# Altium schematic sheet imu.SchDoc
size A
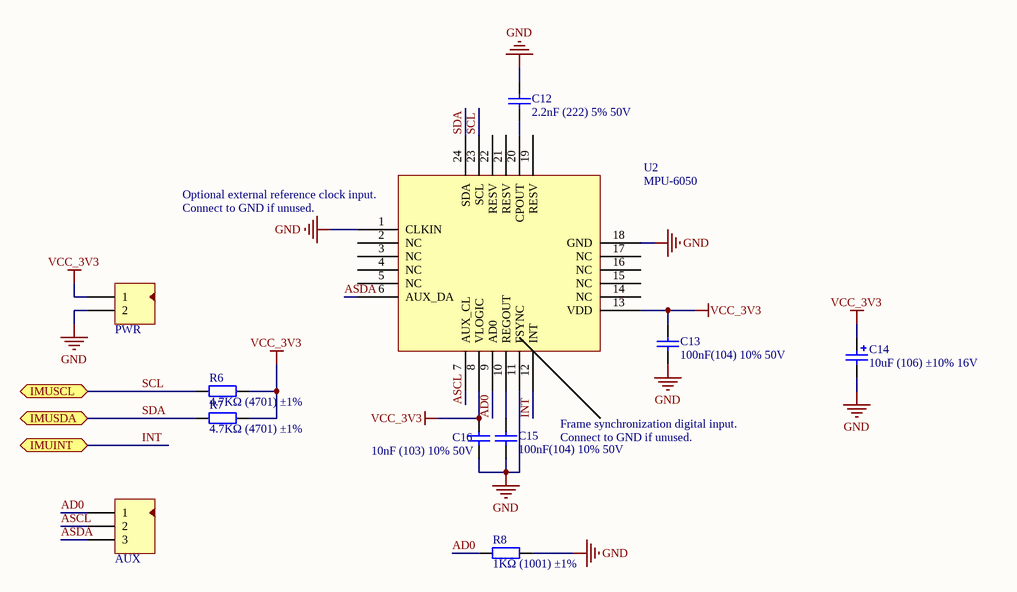
[diagram p0: imu.SchDoc]

## Parts
C12  2.2nF (222) 5% 50V  [LC-0805_C]
C13  100nF(104) 10% 50V  [LC-0805_C]
C14  10uF (106) ±10% 16V  [LC-CASE-A_3216]
C15  100nF(104) 10% 50V  [LC-0805_C]
C16  10nF (103) 10% 50V  [LC-0805_C]
P6  PWR  [HDR2X1-2.54]
P7  AUX  [HDR3X1-2.54]
R6  4.7KΩ (4701) ±1%  [LC-0805_R]
R7  4.7KΩ (4701) ±1%  [LC-0805_R]
R8  1KΩ (1001) ±1%  [LC-0805_R]
U2  MPU-6050  [LC-QFN-24_4x4x05P]

## Ports
IMUINT, IMUSCL, IMUSDA

## Nets
GND: C12.2 C13.1 C14.2 C15.2 C16.1 P6.2 R8.2 U2.1(CLKIN) U2.11(FSYNC) U2.18(GND)
VCC_3V3: C13.2 C14.1 C16.2 P6.1 R6.2 R7.2 U2.8(VLOGIC) U2.13(VDD)
AD0: P7.1 R8.1 U2.9(AD0)
ASCL: P7.2 U2.7(AUX_CL)
ASDA: P7.3 U2.6(AUX_DA)
INT: U2.12(INT) ; port IMUINT
SCL: R6.1 U2.23(SCL) ; port IMUSCL
SDA: R7.1 U2.24(SDA) ; port IMUSDA
NetC12_1: C12.1 U2.20(CPOUT)
NetC15_1: C15.1 U2.10(REGOUT)

Not connected (* = marked no-connect by the designer): U2 2(NC) 3(NC) 4(NC) 5(NC) 14(NC) 15(NC) 16(NC) 17(NC) 19(RESV) 21(RESV) 22(RESV)

## Notes on the sheet
- (near U2) Optional external reference clock input.
- Connect to GND if unused.
- Frame synchronization digital input.

## Library data of the parts
C12 = 0805 2.2nF (222) 5% 50V: 贴片电容; ComponentLink1Description: 供应商链接; ComponentLink1URL: http://www.szlcsc.com/product/details_29010.html; Package: 0805; Supplier: LC; SuppliersPartNumber: C28260
C13 C15 = 0805 100nF(104) 10% 50V: 贴片电容; ComponentLink1Description: 供应商链接; ComponentLink1URL: http://www.szlcsc.com/product/details_50686.html; Package: 0805; Supplier: LC; SuppliersPartNumber: C49678
C14 = 3216 10uF (106) 10% 16V: 钽电容; ComponentLink1Description: 供应商链接; ComponentLink1URL: http://www.szlcsc.com/product/details_7643.html; Package: 3216; Supplier: LC; SuppliersPartNumber: C7171
C16 = 0805 10nF (103) 10% 50V: 贴片电容; ComponentLink1Description: 供应商链接; ComponentLink1URL: http://www.szlcsc.com/product/details_2062.html; Package: 0805; Supplier: LC; SuppliersPartNumber: C1710
P6 = Header 2: 接插件; LatestRevisionDate: 17-Jul-2002; LatestRevisionNote: Re-released for DXP Platform.; Publisher: Altium Limited
P7 = Header 3: 接插件; LatestRevisionDate: 17-Jul-2002; LatestRevisionNote: Re-released for DXP Platform.; Publisher: Altium Limited
R6 R7 = 0805 4.7KΩ (4701) 1%: 贴片电阻; ComponentLink1Description: 供应商链接; ComponentLink1URL: http://www.szlcsc.com/product/details_18361.html; Package: 0805; Supplier: LC; SuppliersPartNumber: C17673
R8 = 0805 1KΩ (1001) 1%: 贴片电阻; ComponentLink1Description: 供应商链接; ComponentLink1URL: http://www.szlcsc.com/product/details_18201.html; Package: 0805; Supplier: LC; SuppliersPartNumber: C17513
U2 = MPU-6050: 传感器; ComponentLink1Description: 供应商链接; ComponentLink1URL: http://www.szlcsc.com/product/details_24852.html; Package: QFN-24_4x4x05P; Supplier: LC; SuppliersPartNumber: C24112